# EAGLE design LilyPad_LiPower (EAGLE 7.2.0)
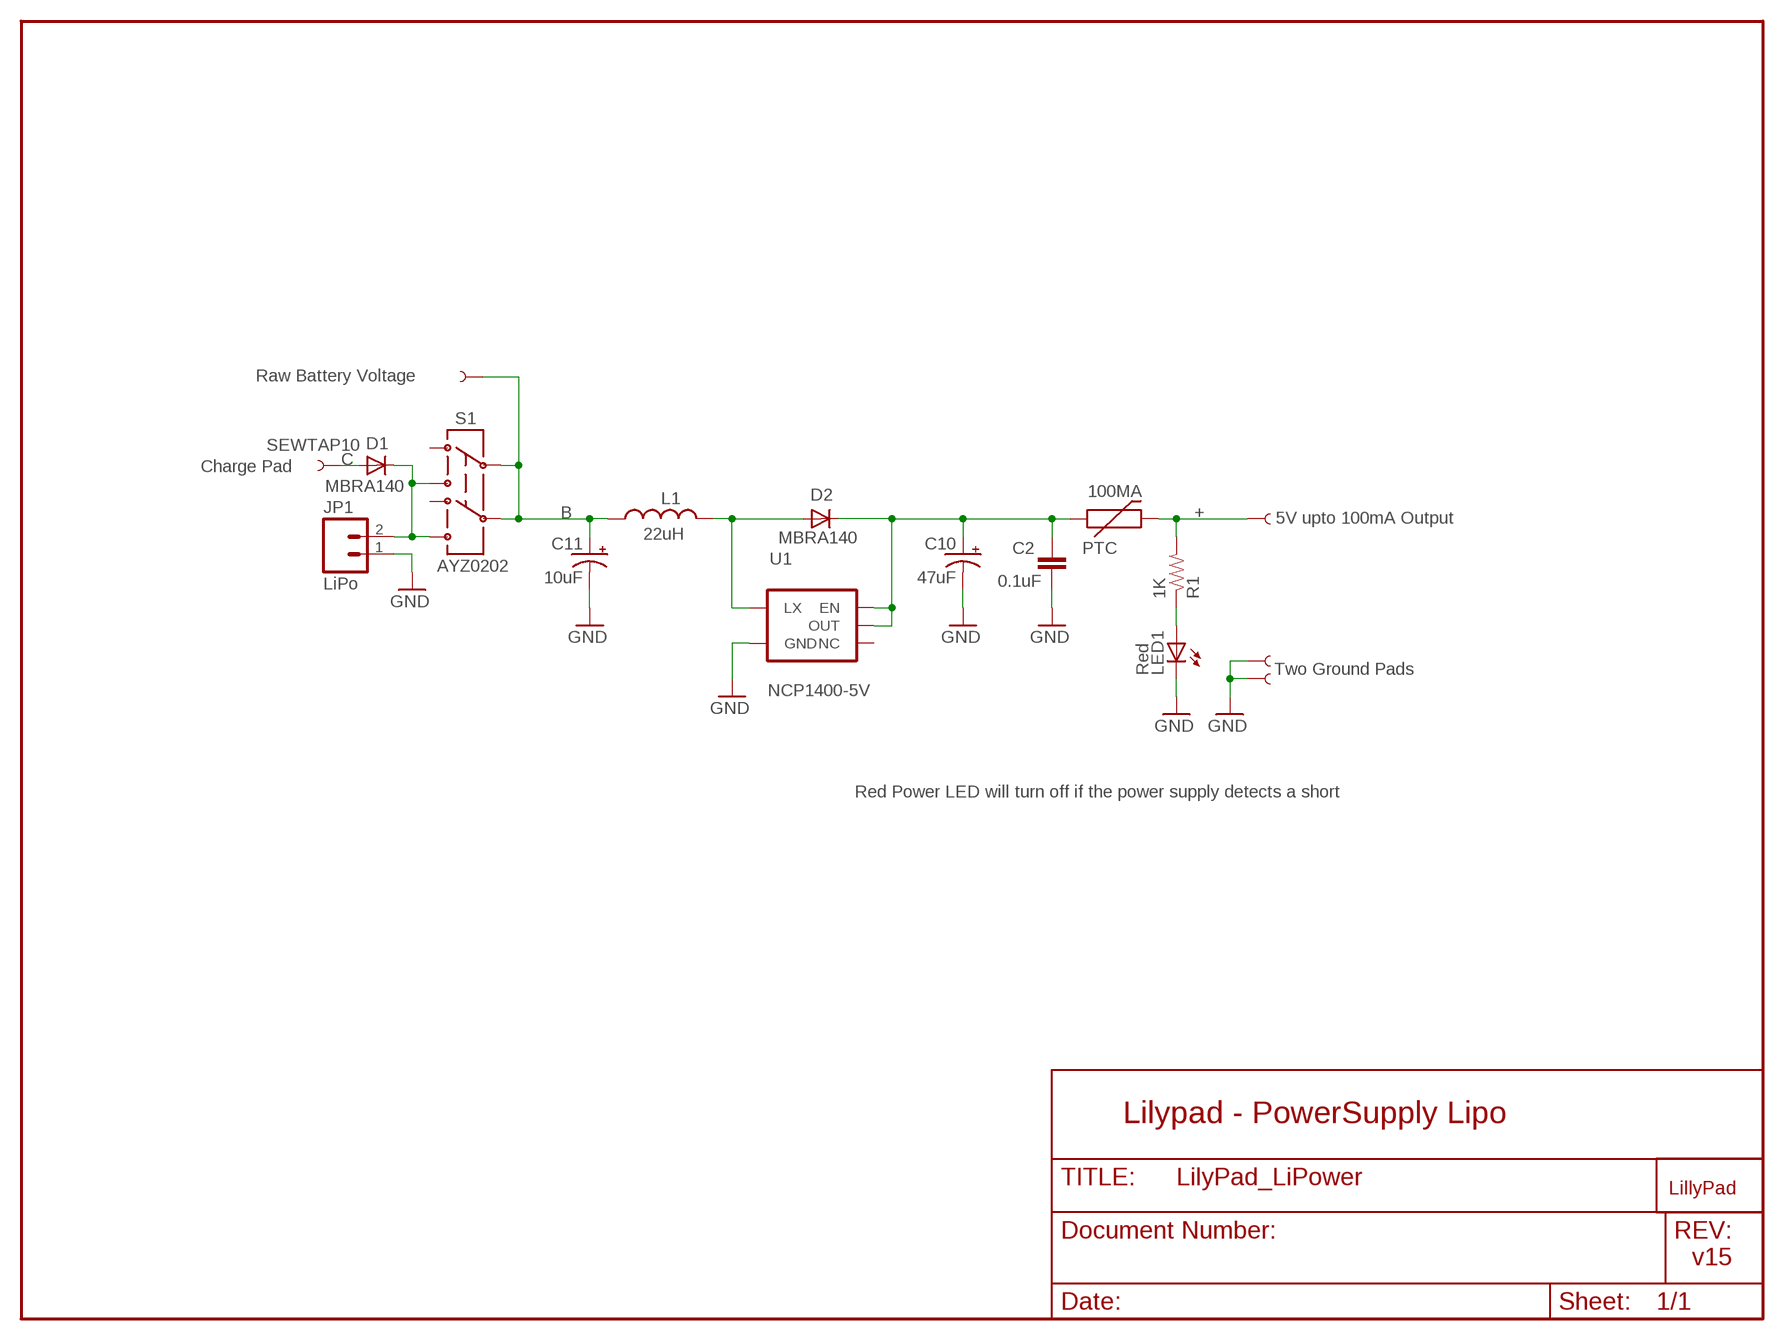
[diagram p0: schematic, sheet 1]

## Parts
100MA  PTC  PTCSMD  [PTC-1206]
C2  0.1uF  CAP0603-CAP  [0603-CAP]
C10  47uF  CAP_POL2  [EIA3528-21]
C11  10uF  CAP_POL1206  [CPOL_1206]
D1  MBRA140  DIODESMA  [SMA-DIODE]
D2  MBRA140  DIODESMA  [SMA-DIODE]
JP1  LiPo  M02-JST-2MM-SMT  [JST-2-SMD]
L1  22uH  INDUCTORCR54  [CR54]
LED1  Red  LED1206  [LED-1206]
R1  1K  RESISTOR0603-RES  [0603-RES]
S1  AYZ0202  [AYZ0202]
U1  NCP1400-5V  V_REG_NCP1400SOT23-5  [SOT23-5]
U$1  SEWTAP10  [PETAL-LONG-2-2SIDE]
U$2  SEWTAP10  [PETAL-LONG-2-2SIDE]
U$3  SEWTAP10  [PETAL-LONG-2-2SIDE]
U$4  SEWTAP10  [PETAL-LONG-2-2SIDE]
U$5  SEWTAP10  [PETAL-LONG-2-2SIDE]
U$7  LOGO-LPLP  [LOGO-LILYPAD]

## Nets
+: 100MA.2 R1.2 U$1.1
B: C11.A(+) L1.P$2 S1.2 S1.5 U$3.1
C: D1.A U$2.1
GND: C2.2 C10.C(-) C11.C(-) JP1.1 LED1.C U1.4(GND) U$4.1 U$5.1
N$1: LED1.A R1.1
N$2: 100MA.1 C2.1 C10.A(+) D2.C U1.1(EN) U1.2(OUT)
N$5: D1.C JP1.2 S1.1 S1.4
N$16: D2.A L1.P$1 U1.5(LX)
Unconnected: S1.3 S1.6 U1.3(NC)

## Notes on the sheet
- Raw Battery Voltage
- Charge Pad
- 5V upto 100mA Output
- Two Ground Pads
- Red Power LED will turn off if the power supply detects a short
- Lilypad - PowerSupply Lipo
- v15

## Library data of the parts
100MA = SparkFun:PTC: Resettable Fuse PTC Resettable Fuse. Spark Fun Electronics SKU : COM-08357
C2 = SparkFun:CAP: Capacitor Standard 0603 ceramic capacitor, and 0.1" leaded capacitor.
C10 C11 = SparkFun-Nate:CAP_POL
D1 D2 = SparkFun-Nate:DIODE
JP1 = SparkFun:M02: Header 2 Standard 2-pin 0.1" header. Use with straight break away headers (SKU : PRT-00116), right angle break away headers (PRT-00553), swiss pins (PRT-00743), machine pins (PRT-00117), and female headers (PRT-00115). Molex polarized connector foot print use with SKU : PRT-08233 with associated crimp pins and housings.
L1 = SparkFun-Nate:INDUCTOR: Basic Inductor/Choke - 0603 and 1206
LED1 = SparkFun:LED: LEDs Standard schematic elements and footprints for 5mm, 3mm, 1206, and 0603 sized LEDs. 5mm - Spark Fun Electronics SKU : COM-00529 (and others)
R1 = SparkFun:RESISTOR: Resistor Basic schematic elements and footprints for 0603, 1206, and PTH resistors.
S1 = SparkFun:AYZ0202: SPDT Slide Switch Simple SMD single-pull double-throw slide switch. Good for less than 350mA power switch, switching UARTs between devices, etc. Spark Fun Electronics SKU : COM-00597
U1 = SparkFun:V_REG_NCP1400: Switching step-up voltage regulator NCP1400 switiching regulator takes single cell AA and outputs 100mA at 3.3V or 5V with minimal number of external components.
U$1-U$5 = LilyPad-Wearables:SEWTAP
U$7 = LilyPad-Wearables:LOGO-LP

## Net classes
0 Default: width 0.203 mm
1 Power: width 0.305 mm
3 ButtonSignal: width 0.203 mm

## Board
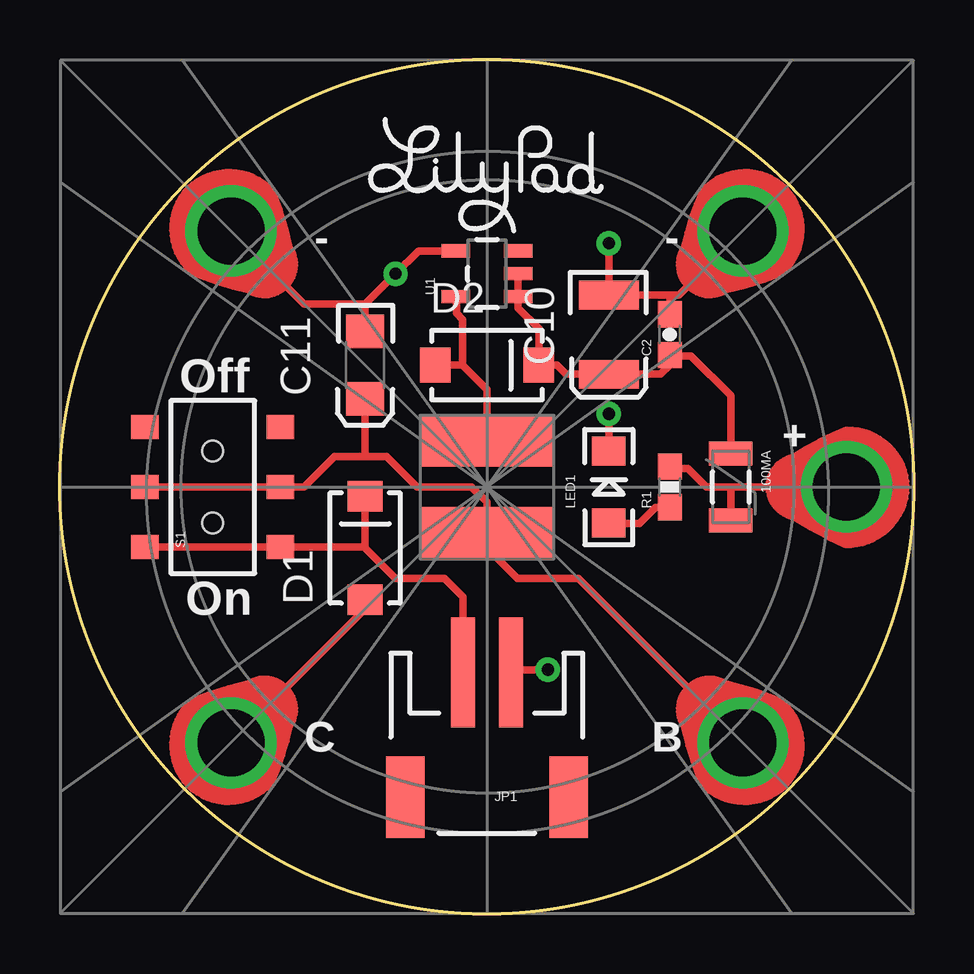
[diagram p1: board, top side]
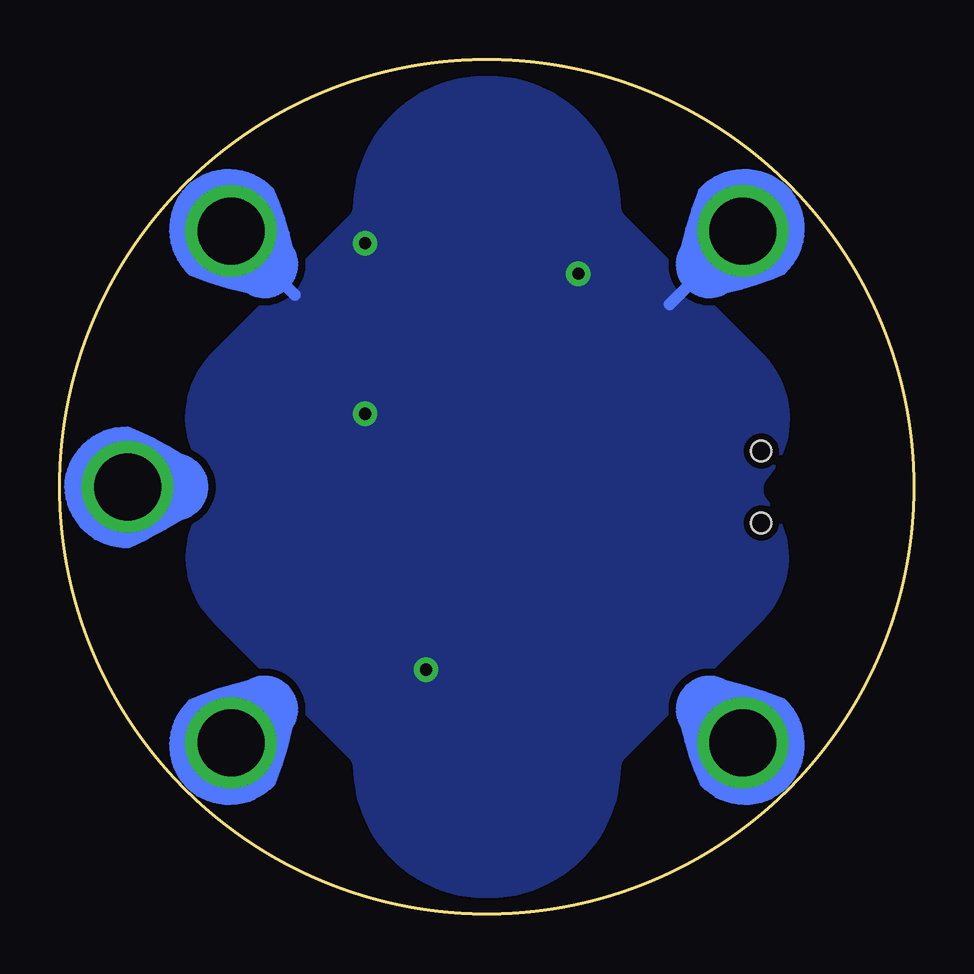
[diagram p2: board, bottom side, seen from below]

Size 35.6 x 35.6 mm. Coordinates in mm from the lower left corner, seen from the top.
Outline: circle at 17.8,17.8 radius 17.8
Copper layers (1*16): Top 0.035mm / dielectric 1.5mm / Bottom 0.035mm
Design rules "SparkFun": minimum track width 8mil, minimum drill 20mil, track to track 8mil, track to pad 8mil, pad to pad 8mil, via to via 8mil, smd to smd 8mil, copper to edge 10mil, drill to drill 8mil, minimum pad ring 12mil, minimum via ring 10mil, stop-mask expansion 4mil, vias tented up to drill 20mil, thermal gap 10mil
bRestrict: area 0,0 to 35.6,35.6

### Footprints (pad centres in the part's own frame; a part is rotated, then mirrored left to right if it is on the bottom)
PTC-1206 = smd 1 x 1.8: 1 -1.4,0; 2 1.4,0
0603-CAP = smd 1.1 x 1: 1 -0.85,0; 2 0.85,0
EIA3528-21 = smd 2.5 x 1.2: A 0,-1.65; C 0,1.65
CPOL_1206 = smd 1.6 x 1.4: A 0,-1.4; C 0,1.4
SMA-DIODE = smd 1.27 x 1.47: A -2.15,0; C 2.15,0
JST-2-SMD = smd 1 x 4.6: 1 -1,-3.7; 2 1,-3.7 | smd 1.6 x 3.4: NC1 -3.4,1.5; NC2 3.4,1.5
CR54 = smd 5.5 x 2.15: P$1 0,1.92; P$2 0,-1.92
LED-1206 = smd 1.2 x 1.4: A -1.5,0; C 1.5,0
0603-RES = smd 1.1 x 1: 1 -0.85,0; 2 0.85,0
AYZ0202 = smd 1 x 1.15: 1 -2.5,2.825; 2 0,2.825; 3 2.5,2.825; 4 -2.5,-2.825; 5 0,-2.825; 6 2.5,-2.825 | hole 0.85: 1.5,0; -1.5,0
SOT23-5 = smd 0.55 x 1.2: 1 -0.95,-1.3; 2 0,-1.3; 3 0.95,-1.3; 4 0.95,1.3; 5 -0.95,1.3
PETAL-LONG-2-2SIDE = drill 2.794: 1 0,0

### Placement (x,y rotation side)
100MA  27.96,17.8 270 top
C2  25.42,24.15 90 top
C10  22.88,24.15 0 top
C11  12.72,22.88 0 top
D1  12.72,15.26 90 top
D2  17.8,22.88 0 top
JP1  17.8,6.37 180 top
L1  17.8,17.8 0 top
LED1  22.88,17.8 90 top
R1  25.42,17.8 90 top
S1  6.37,17.8 90 top
U1  17.8,26.69 90 top
U$1  32.79,17.8 90 top
U$2  7.13,7.13 315 top
U$3  28.47,7.13 45 top
U$4  28.47,28.47 135 top
U$5  7.13,28.47 225 top
U$7  17.8,31.13 0 top

### Tracks (layer width: path | path; a pad name or v marks a point on that pad's centre or on a via)
+
  Top 0.305: 27.96,17.8 26.94,17.8 26.18,18.56 25.55,18.56 25.46,18.65 R1.2 | 27.96,17.8 U$1.1 | 27.96,17.8 100MA.2
B
  Top 0.305: 17.8,16.4 17.8,15.89 | 17.8,16.4 17.8,16.53 | 12.72,19.07 C11.A | 18.05,16.28 L1.P$2 17.8,15.89 | S1.2 S1.5 10.18,17.8 11.45,19.07 12.72,19.07 | 12.72,19.07 13.61,19.07 14.88,17.8 17.16,17.8 17.8,17.16 17.8,16.4 | U$3.1 21.61,13.99 19.07,13.99 17.8,15.26 17.8,15.89
C
  Top 0.305: D1.A 12.72,12.72 U$2.1
GND  (via drill 0.51)
  Top 0.305: C2.2 25.42,25.8 | 25.42,25.8 25.29,25.8 C10.C v22.88,27.96 | LED1.C v22.88,20.85 | 18.82,10.43 JP1.1 18.91,10.18 v20.34,10.18 | 12.72,24.15 C11.C 12.72,25.42 | U1.4 14.94,27.64 v13.99,26.69 12.72,25.42 | 12.72,25.42 10.18,25.42 8.91,26.69 | U$4.1 25.8,25.8 25.42,25.8
  Bottom 0.508: U$5.1 10.18,25.42 | U$4.1 25.8,25.8
  pour Bottom (isolate 0.305): 35.58,0.02 0.02,0.02 -0.23,15.26 -0.23,20.59 0.02,35.58 35.58,35.58
N$1
  Top 0.305: R1.1 24.82,16.95 24.15,16.28 22.88,16.28 LED1.A
N$2
  Top 0.305: U1.2 19.1,25.83 19.07,25.8 19.1,25.77 U1.1 19.1,25.26 19.96,24.4 D2.C 20.72,22.88 21.1,22.5 C10.A 25.04,22.5 25.42,22.88 25.42,23.26 | 100MA.1 27.96,21.61 26.31,23.26 25.42,23.26 | 25.42,23.26 C2.1
N$5
  Top 0.305: 12.72,17.8 D1.C 12.72,15.26 | 12.72,15.26 13.99,13.99 16.02,13.99 16.8,13.21 JP1.2 | 12.72,15.26 12.68,15.3 S1.4 3.62,15.3 3.58,15.26 S1.1
N$16
  Top 0.305: L1.P$1 17.8,21.86 16.78,22.88 | 16.78,22.88 16.78,24.79 16.53,25.04 16.53,25.67 16.5,25.7 U1.5 | 16.78,22.88 D2.A

### Text on the board
tPlace: - | - | Off | + | On | C | B
tValues: 22uH